# EAGLE design MPO21 (EAGLE 9.6.2)
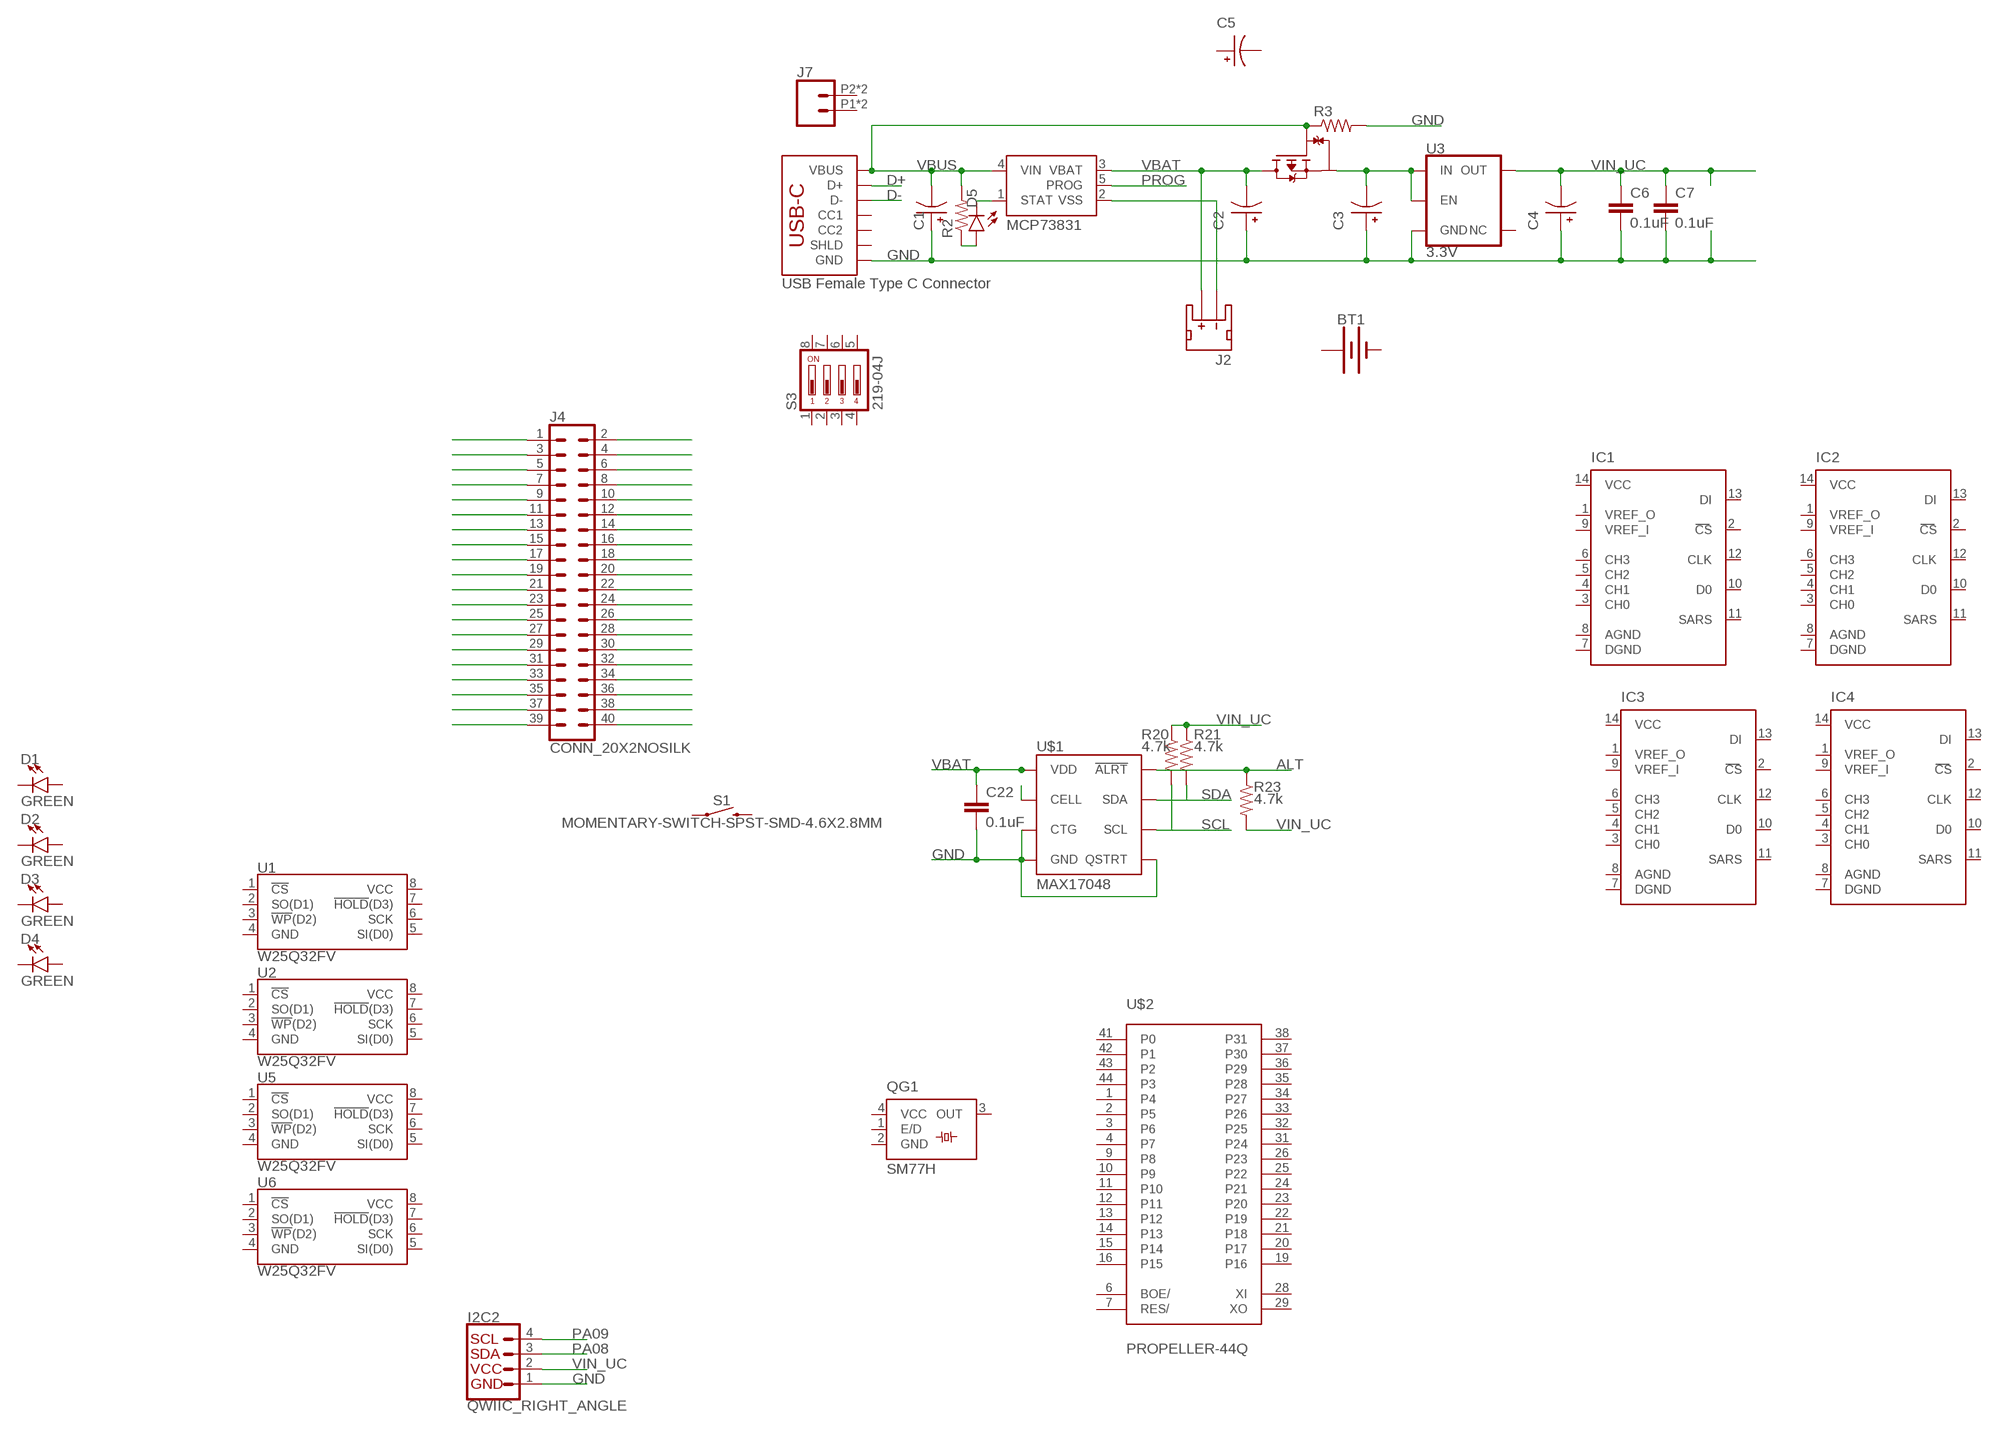
[diagram p0: schematic, sheet 1]

## Parts
BT1  BATTERY-20MM_SMD_4LEGS_OVERPASTE_INNER  [BATTCON_20MM_4LEGS_OVERPASTE_INNER]
C1  EEEFC1H1R0R  [CAP_EEEFC1H1R0R]
C2  EEEFC1H1R0R  [CAP_EEEFC1H1R0R]
C3  EEEFC1H1R0R  [CAP_EEEFC1H1R0R]
C4  EEEFC1H1R0R  [CAP_EEEFC1H1R0R]
C5  EEEFC1H1R0R  [CAP_EEEFC1H1R0R]
C6  0.1uF  C-EUC0603  [C0603]
C7  0.1uF  C-EUC0603  [C0603]
C22  0.1uF  C-EUC0603  [C0603]
D1  GREEN  LED-GREEN1206  [LED-1206]
D2  GREEN  LED-GREEN1206  [LED-1206]
D3  GREEN  LED-GREEN1206  [LED-1206]
D4  GREEN  LED-GREEN1206  [LED-1206]
D5  GREEN  LED-GREEN1206  [LED-1206]
I2C2  QWIIC_RIGHT_ANGLE  QWIIC_CONNECTORJS-1MM  [JST04_1MM_RA]
IC1  ADC08034D  [SO14]
IC2  ADC08034D  [SO14]
IC3  ADC08034D  [SO14]
IC4  ADC08034D  [SO14]
J2  JST_2MM_MALE  [JST-2-SMD]
J4  CONN_20X2NOSILK  [2X20_NOSILK]
J7  CONN_02SMALL_POKEHOME  [1X02_POKEHOME]
J9  USB Female Type C Connector  USB_C_4-LAYER-ISOLATED  [USB-C-16P-4LAYER-ISOLATED]
Q1  DMP1045U  [SOT91P240X110-3N]
QG1  SM77H  [SM77H]
R2  R-US_R0603  [R0603]
R3  R-US_R0603  [R0603]
R20  4.7k  R-US_R0603  [R0603]
R21  4.7k  R-US_R0603  [R0603]
R23  4.7k  R-US_R0603  [R0603]
S1  MOMENTARY-SWITCH-SPST-SMD-4.6X2.8MM  [TACTILE_SWITCH_SMD_4.6X2.8MM]
S3  219-04J  [CTS-219-04J]
U1  W25Q32FV  W25Q32FVSS  [SOIC-8]
U2  W25Q32FV  W25Q32FVSS  [SOIC-8]
U3  3.3V  V_REG_AP2112K-3.3V  [SOT23-5]
U4  MCP73831  [SOT23-5]
U5  W25Q32FV  W25Q32FVSS  [SOIC-8]
U6  W25Q32FV  W25Q32FVSS  [SOIC-8]
U$1  MAX17048  MAX17048DFN8  [DFN-8]
U$2  PROPELLER-44Q  [Q44]

## Nets
ALT: R23.1 U$1.P$5(!ALRT)
D+: J9.A6(D+) J9.B6(D+)
D-: J9.A7(D-) J9.B7(D-)
GND: C1.1 C2.1 C3.1 C4.1 C6.2 C7.2 C22.2 I2C2.1 J9.GND J9.GND2(GND) R3.2 U3.2(GND) U$1.P$1(CTG) U$1.P$4(GND) U$1.P$6(QSTRT) U$1.P$9(GND)
N$10: C3.2 Q1.2(S) U3.1(IN) U3.3(EN)
N$11: D5.C U4.1(STAT)
N$12: J2.1(-) U4.2(VSS)
N$13: D5.A R2.1
N$43: U$1.P$2(CELL)
N$90: J4.2
N$91: J4.3
N$92: J4.4
N$93: J4.5
N$94: J4.6
N$95: J4.7
N$96: J4.8
N$97: J4.9
N$98: J4.10
N$99: J4.11
N$100: J4.12
N$101: J4.13
N$102: J4.14
N$103: J4.15
N$104: J4.16
N$105: J4.17
N$106: J4.18
N$107: J4.19
N$108: J4.20
N$109: J4.21
N$110: J4.22
N$111: J4.23
N$112: J4.24
N$113: J4.25
N$114: J4.26
N$115: J4.27
N$116: J4.28
N$117: J4.29
N$118: J4.30
N$119: J4.31
N$120: J4.32
N$121: J4.33
N$122: J4.34
N$123: J4.35
N$124: J4.36
N$125: J4.37
N$126: J4.38
N$127: J4.39
N$128: J4.40
PA01: J4.1
PA08: I2C2.3
PA09: I2C2.4
PROG: U4.5(PROG)
SCL: R20.2 U$1.P$7(SCL)
SDA: R21.2 U$1.P$8(SDA)
VBAT: C2.2 C22.1 J2.2(+) Q1.3(D) U4.3(VBAT) U$1.P$3(VDD)
VBUS: C1.2 J9.VBUS1(VBUS) J9.VBUS2(VBUS) Q1.1(G) R2.2 R3.1 U4.4(VIN)
VIN_UC: C4.2 C6.1 C7.1 I2C2.2 R20.1 R21.1 R23.2 U3.5(OUT)
Unconnected: C5.1 C5.2 D1.A D1.C D2.A D2.C D3.A D3.C D4.A D4.C IC1.1(VREF_O) IC1.2(CS) IC1.3(CH0) IC1.4(CH1) IC1.5(CH2) IC1.6(CH3) IC1.9(VREF_I) IC1.10(D0) IC1.11(SARS) IC1.12(CLK) IC1.13(DI) IC2.1(VREF_O) IC2.2(CS) IC2.3(CH0) IC2.4(CH1) IC2.5(CH2) IC2.6(CH3) IC2.9(VREF_I) IC2.10(D0) IC2.11(SARS) IC2.12(CLK) IC2.13(DI) IC3.1(VREF_O) IC3.2(CS) IC3.3(CH0) IC3.4(CH1) IC3.5(CH2) IC3.6(CH3) IC3.9(VREF_I) IC3.10(D0) IC3.11(SARS) IC3.12(CLK) IC3.13(DI) IC4.1(VREF_O) IC4.2(CS) IC4.3(CH0) IC4.4(CH1) IC4.5(CH2) IC4.6(CH3) IC4.9(VREF_I) IC4.10(D0) IC4.11(SARS) IC4.12(CLK) IC4.13(DI) J2.NC1(PAD1) J2.NC2(PAD2) J7.P1 J7.P2 J7.P3 J7.P4 J9.A5(CC1) J9.B5(CC2) J9.SHLD1(SHLD) J9.SHLD2(SHLD) J9.SHLD3(SHLD) J9.SHLD4(SHLD) J9.SHLD5(SHLD) J9.SHLD6(SHLD) J9.SHLD7(SHLD) J9.SHLD8(SHLD) QG1.1(E/D) QG1.3(OUT) S1.1 S1.2 S1.3 S1.4 S3.1 S3.2 S3.3 S3.4 S3.5 S3.6 S3.7 S3.8 U1.1(!CS!) U1.2(SO(D1)) U1.3(!WP!(D2)) U1.4(GND) U1.5(SI(D0)) U1.6(SCK) U1.7(!HOLD!(D3)) U1.8(VCC) U2.1(!CS!) U2.2(SO(D1)) U2.3(!WP!(D2)) U2.4(GND) U2.5(SI(D0)) U2.6(SCK) U2.7(!HOLD!(D3)) U2.8(VCC) U3.4(NC) U5.1(!CS!) U5.2(SO(D1)) U5.3(!WP!(D2)) U5.4(GND) U5.5(SI(D0)) U5.6(SCK) U5.7(!HOLD!(D3)) U5.8(VCC) U6.1(!CS!) U6.2(SO(D1)) U6.3(!WP!(D2)) U6.4(GND) U6.5(SI(D0)) U6.6(SCK) U6.7(!HOLD!(D3)) U6.8(VCC) U$2.1(P4) U$2.2(P5) U$2.3(P6) U$2.4(P7) U$2.6(BOE/) U$2.7(RES/) U$2.9(P8) U$2.10(P9) U$2.11(P10) U$2.12(P11) U$2.13(P12) U$2.14(P13) U$2.15(P14) U$2.16(P15) U$2.19(P16) U$2.20(P17) U$2.21(P18) U$2.22(P19) U$2.23(P20) U$2.24(P21) U$2.25(P22) U$2.26(P23) U$2.28(XI) U$2.29(XO) U$2.31(P24) U$2.32(P25) U$2.33(P26) U$2.34(P27) U$2.35(P28) U$2.36(P29) U$2.37(P30) U$2.38(P31) U$2.41(P0) U$2.42(P1) U$2.43(P2) U$2.44(P3)

## Notes on the sheet
- R20 | R21
- R23

## Power pins joined to a net without a drawn wire
+: BT1.1(+)
-: BT1.2(-)
AGND: IC1.8(AGND) IC2.8(AGND) IC3.8(AGND) IC4.8(AGND)
DGND: IC1.7(DGND) IC2.7(DGND) IC3.7(DGND) IC4.7(DGND)
GND: QG1.2(GND)
VCC: IC1.14(VCC) IC2.14(VCC) IC3.14(VCC) IC4.14(VCC) QG1.4(VCC)
VDD: U$2.8(VDD) U$2.18(VDD) U$2.30(VDD) U$2.40(VDD)
VSS: U$2.5(VSS) U$2.17(VSS) U$2.27(VSS) U$2.39(VSS)

## Library data of the parts
BT1 = SparkFun-Batteries:BATTERY: Battery - Single Cell A variety of battery chemistries, sizes, and footprints. Device List: 20MM_PTH - Coin Cell Battery Holder - 20mm (PTH) <https://www.sparkfun.com/products/783> 20MM_PTH_KIT- Coin Cell battery Holder - 20 mm (PTH) <http://www.sparkfun.com/products/783>kit version with special mask 6.8MM_PTH - Coin Cell Battery Holder - 6.8MM(SMD) <https://www.digikey.com/product-detail/en/seiko-instruments/MS621FE-FL11E/728-1057-ND/1889208?WT.srch=1&gclid=CNOQ5a6LzdQCFZS2wAodXCkE0g> 12MM_SMD - Coin Cell Battery Holder - 12mm (SMD) <https://www.sparkfun.com/products/10592> 12MM_PTH - Coin Cell Battery Holder - 12mm (PTH) <https://www.sparkfun.com/products/7948> 20MM_SMD - 20mm Coin Cell Battery Holder (SMD) (2 legs) Used on the Big Time Watch Kit <https://www.sparkfun.com/products/11734> 20MM_SMD_4LEGS - Coin Cell Battery Holder - 20mm (SMD) <https://www.sparkfun.com/products/11892> 20MM_SMD_4LEGS_OVERPASTE - Coin Cell Battery Holder - 20mm (SMD) <https://www.sparkfun.com/products/11892> (Over-paste on the legs) 24.5MM_PTH - Coin Cell Battery Holder - 24.5mm (PTH) <https://www.sparkfun.com/products/8863> 9V - 9V Battery Holder - PC Mount Used on the SparkFun SparkPunk Sound Kit <https://www.sparkfun.com/products/11177> and SparkFun SparkPunk Sequencer Kit <https://www.sparkfun.com/products/12707> 18650 - Battery Holder - 18650 (PTH) <https://www.sparkfun.com/products/13113> AA - Battery Holder - 1xAA (PTH) <https://www.sparkfun.com/products/7949> AAA - Battery Holder - 1xAAA (PTH) <https://www.sparkfun.com/products/12718> AA_KIT - Battery Holder - 1xAA (PTH) <https://www.sparkfun.com/products/7949> Special kit package - pads only have exposed copper on one side of the board. AAA_KIT - Battery Holder - 1xAAA (PTH) <https://www.sparkfun.com/products/12718> Special kit package - pads only have exposed copper on one side of the board.
C1-C5 = EEEFC1H1R0R:EEEFC1H1R0R; MANUFACTURER: Panasonic; MAXIMUM_PACKAGE_HEIGHT: 5.4mm; PARTREV: 10-Oct-19; STANDARD: Manufacturer Recommendations
C6 C7 C22 = rcl:C-EU: CAPACITOR, European symbol; SPICEPREFIX: C
D1-D5 = SparkFun-LED:LED-GREEN: Green SMD LED Used in manufacturing of various products at SparkFun Packages: 0603 - SMD 0603 package [Product Link] <http://www.futureelectronics.com/en/technologies/semiconductors/optoelectronics/leds/Pages/9894312-LTST-C190GKT.aspx?CrossPart=HSMG-C190&IM=0> LilyPad 1206 - SMD1206 LilyPad package [Product Link] <http://www.futureelectronics.com/en/Technologies/Product.aspx?ProductID=IN150NGHARVATEKCORPORATION2049943&IM=0> 1206 - SMD1206 package [Product Link] <http://www.futureelectronics.com/en/technologies/semiconductors/optoelectronics/leds/Pages/8315665-LTST-C150KGKT.aspx?IM=0> 1206 Bottom Mount -SMD 1206 Bottom Mount [Product Link] <http://www.digikey.com/product-detail/en/lite-on-inc/LTST-C230KGKT/160-1456-1-ND/386854> SparkFun Products: Pro Mini 328 -5V <https://www.sparkfun.com/products/821> RedBoard <https://www.sparkfun.com/products/12757> MP3 Trigger <https://www.sparkfun.com/products/13720> Makey Makey <https://www.sparkfun.com/products/11076>; PROD_ID: DIO-00862
I2C2 = SparkFun-Connectors:QWIIC_CONNECTOR: SparkFun I2C Standard Qwiic Connector An SMD 1mm pitch JST connector makes it easy and quick (get it? Qwiic?) to connect I2C devices to each other. The Qwiic system <http://www.sparkfun.com/qwiic> enables fast and solderless connection between popular platforms and various sensors and actuators. We carry 200mm <https://www.sparkfun.com/products/14204>, 100mm <https://www.sparkfun.com/products/14205>, 50mm <https://www.sparkfun.com/products/14206>, and breadboard friendly <https://www.sparkfun.com/products/14207> Qwiic cables. We also offer 10 pcs strips <https://www.sparkfun.com/products/14323> the SMD connectors.; PROD_ID: CONN-13694
IC1-IC4 = linear:ADC08034: A/D CONVERTER
J2 = SparkFun-Connectors:JST_2MM_MALE: JST 2MM MALE RA CONNECTOR Two pin, compact surface mount connector. Commonly used as a battery input connection point. We really like the solid locking feeling and high current rating on these small connectors. We use these all the time as battery connectors. Mates to single-cell LiPo batteries. Here is the connector we sell at SparkFun: JST Right Angle Connector - White <https://www.sparkfun.com/products/8612> (PRT-08612) Datasheet <http://www.sparkfun.com/datasheets/Prototyping/Connectors/JST-Horizontal.pdf> It was used on these SparkFun products: SparkFun MOSFET Power Controller <https://www.sparkfun.com/products/11214> (PRT-11214) SparkFun Battery Babysitter - LiPo Battery Manager <https://www.sparkfun.com/products/13777> (PRT-13777) And many, many others that required a lipo battery connection.; PROD_ID: CONN-11443; SF_ID: PRT-08612
J4 = SparkFun-Connectors:CONN_20X2: Multi connection point. Often used as Generic Header-pin footprint for 0.1 inch spaced/style header connections On any of the 0.1 inch spaced packages, you can populate with these: Break Away Headers - Straight <https://www.sparkfun.com/products/116> (PRT-00116) Break Away Male Headers - Right Angle <https://www.sparkfun.com/products/553> (PRT-00553) Female Headers <https://www.sparkfun.com/products/115> (PRT-00115) Break Away Headers - Machine Pin <https://www.sparkfun.com/products/117> (PRT-00117) Break Away Female Headers - Swiss Machine Pin <https://www.sparkfun.com/products/743> (PRT-00743)
J7 = SparkFun-Connectors:CONN_02: Multi connection point. Often used as Generic Header-pin footprint for 0.1 inch spaced/style header connections On any of the 0.1 inch spaced packages, you can populate with these: Break Away Headers - Straight <https://www.sparkfun.com/products/116> (PRT-00116) Break Away Male Headers - Right Angle <https://www.sparkfun.com/products/553> (PRT-00553) Female Headers <https://www.sparkfun.com/products/115> (PRT-00115) Break Away Headers - Machine Pin <https://www.sparkfun.com/products/117> (PRT-00117) Break Away Female Headers - Swiss Machine Pin <https://www.sparkfun.com/products/743> (PRT-00743) For SCREWTERMINALS and SPRING TERMINALS visit here: Screw Terimnals on SparkFun.com <https://www.sparkfun.com/search/results?term=Screw+Terminals> (5mm/3.5mm/2.54mm spacing) This device is also useful as a general connection point to wire up your design to another part of your project. Our various solder wires solder well into these plated through hole pads. Hook-Up Wire - Assortment (Stranded, 22 AWG) <https://www.sparkfun.com/products/11375> (PRT-11375) Hook-Up Wire - Assortment (Solid Core, 22 AWG) <https://www.sparkfun.com/products/11367> (PRT-11367) View the entire wire category on our website here <https://www.sparkfun.com/categories/141> Special notes: Molex polarized connector foot print use with: PRT-08233 with associated crimp pins and housings. 2.54_SCREWTERM for use with PRT-10571. 3.5mm Screw Terminal footprints for PRT-08084 5mm Screw Terminal footprints for use with PRT-08432; PROD_ID: CONN-13512
J9 = SparkFun-Connectors:USB_C: USB Type C 16Pin Connector Super Speed pins not available on the 16-pin purely SMD connector so this part is best for USB 2.0 implementations. D1 and D2 are tied together enabling D+/- no matter which way the cable is plugged into the connector. The two channel configuration pins (CC1/2) are exposed. These are normally connected to ground via 5.1k resistors but can be reconfigured for high current/high power applications.; PROD_ID: CONN-14122
Q1 = DMP1045U:DMP1045U: P-Channel 12V 4A (Ta) 800mW (Ta) Surface Mount SOT-23 Check availability <https://pricing.snapeda.com/parts/DMP1045U/Diodes%20Inc./view-part?ref=eda>; AVAILABILITY: In Stock; DESCRIPTION: P-Channel 12 V 2.6A (Ta) 530mW Surface Mount X2-WLB0808-4 (Type C); MF: Diodes Inc.; MP: DMP1045U; PACKAGE: SOT-23 Diodes Inc.; PRICE: None; PURCHASE-URL: https://pricing.snapeda.com/search/part/DMP1045U/?ref=eda
QG1 = crystal:SM77H: 3.3V CMOS Clock Oscillator Source: www.pletronics.com .. sm77h%203.3v.pdf; OC_FARNELL: unknown; OC_NEWARK: unknown
R2 R3 R20 R21 R23 = rcl:R-US_: RESISTOR, American symbol; SPICEPREFIX: R
S1 = SparkFun-Switches:MOMENTARY-SWITCH-SPST: Momentary Switch (Pushbutton) - SPST Normally-open (NO) SPST momentary switches (buttons, pushbuttons). Variants PTH-12MM - 12mm square, through-hole Momentary Pushbutton Switch - 12mm Square <https://www.sparkfun.com/products/9190> (COM-09190) PTH-6.0MM, PTH-6.0MM-KIT - 6.0mm square, through-hole Mini Pushbutton Switch <https://www.sparkfun.com/products/97> (COM-00097) KIT package intended for soldering kit's - only one side of pads' copper is exposed. PTH-RIGHT-ANGLE-KIT - Right-angle, through-hole Right Angle Tactile Button <https://www.sparkfun.com/products/10791> - Used on SparkFun BigTime Watch Kit <https://www.sparkfun.com/products/11734> SMD-12MM - 12mm square, surface-mount Tactile Button - SMD (12mm) <https://www.sparkfun.com/products/12993> (COM-12993) Used on SparkFun PicoBoard <https://www.sparkfun.com/products/11888> SMD-4.5MM - 4.5mm Square Trackball Switch Used on SparkFun Blackberry Trackballer Breakout <https://www.sparkfun.com/products/13169> SMD-4.6MMX2.8MM - 4.60mm x 2.80mm, surface mount Used on SparkFun SAMD21 Mini Breakout <https://www.sparkfun.com/products/13664> SMD-5.2MM, SMD-5.2-REDUNDANT - 5.2mm square, surface-mount Mini Pushbutton Switch - SMD <https://www.sparkfun.com/products/8720> (COM-08720) Used on Arduino Pro Mini <https://www.sparkfun.com/products/11114> REDUNDANT package connects both switch circuits together SMD-6.0X3.5MM - 6.0 x 3.5mm, surface mount Momentary Reset Switch SMD <https://www.sparkfun.com/products/8229> (COM-08229) SMD-6.2MM-TALL - 6.2mm square, surface mount Tactile Button - SMD (6mm) <https://www.sparkfun.com/products/12992> Used on SparkFun Digital Sandbox <https://www.sparkfun.com/products/12651> SMD-RIGHT-ANGLE - Right-angle, surface mount Used on SparkFun Block for Intel® Edison - Arduino <https://www.sparkfun.com/products/13036>; PROD_ID: SWCH-13065
S3 = switch-dil:219-04*: Surface Mount DIP Switch Series 219 SMT CTS Electronic Components Sourc: www.ctscorp.com; OC_FARNELL: unknown; OC_NEWARK: unknown
U1 U2 U5 U6 = SparkFun-IC-Memory:W25Q32FV: W25Q32FV 32Mb (4MB) Serial Flash Memory The W25Q32FV support the standard Serial Peripheral Interface (SPI), Dual/Quad I/O SPI as well as 2-clocks instruction cycle Quad Peripheral Interface (QPI). 104MHz, SPI, 8-SOIC-EIAJ Datasheet <http://www.winbond.com/resource-files/w25q32fv%20revh%20091613.pdf> SparkFun Products SparkFun Blynk Board - ESP8266 <https://www.sparkfun.com/products/13794> (WRL-13794); PROD_ID: IC-13229
U3 = SparkFun-IC-Power:V_REG_AP2112: AP2112 - 600mA CMOS LDO Regulator w/ Enable The AP2112 is CMOS process low dropout linear regulator with enable function, the regulator delivers a guaranteed 600mA (min.) continuous load current. Features Output Voltage Accuracy: ±1.5% Output Current: 600mA (Min.) Foldback Short Current Protection: 50mA Enable Function to Turn ON/OFF VOUT Low Dropout Voltage (3.3V): 250mV (Typ.) @IOUT=600mA Excellent Load Regulation: 0.2%/A (Typ.) Excellent Line Regulation: 0.02%/V (Typ.) Low Quiescent Current: 55μA (Typ.) Low Standby Current: 0.01μA (Typ.) Low Output Noise: 50μVRMS PSRR: 100Hz -65dB, 1kHz -65dB OTSD Protection Stable with 1.0μF Flexible Cap: Ceramic, Tantalum and Aluminum Electrolytic Operation Temperature Range: -40°C to 85°C ESD: MM 400V, HBM 4000V; PROD_ID: VREG-12457
U4 = SparkFun-IC-Power:MCP73831: MCP73831T Li-Ion, Li-Pol Controller Miniature single cell, fully integrated Li-Ion, Li-polymer charge management controller Datasheet <http://ww1.microchip.com/downloads/en/DeviceDoc/20001984g.pdf> SparkFun Products: SparkFun ESP32 Thing <https://www.sparkfun.com/products/13907> SparkFun 9DoF Razor IMU M0 <https://www.sparkfun.com/products/14001>; PROD_ID: IC-09995
U$1 = SparkFun-IC-Power:MAX17048: Micropower 1-Cell Li+ ModelGauge SparkFun Products Qduino Mini <https://www.sparkfun.com/products/13614> (DEV-13614); PROD_ID: IC-12551
U$2 = Parallax:PROPELLER-44

## Board
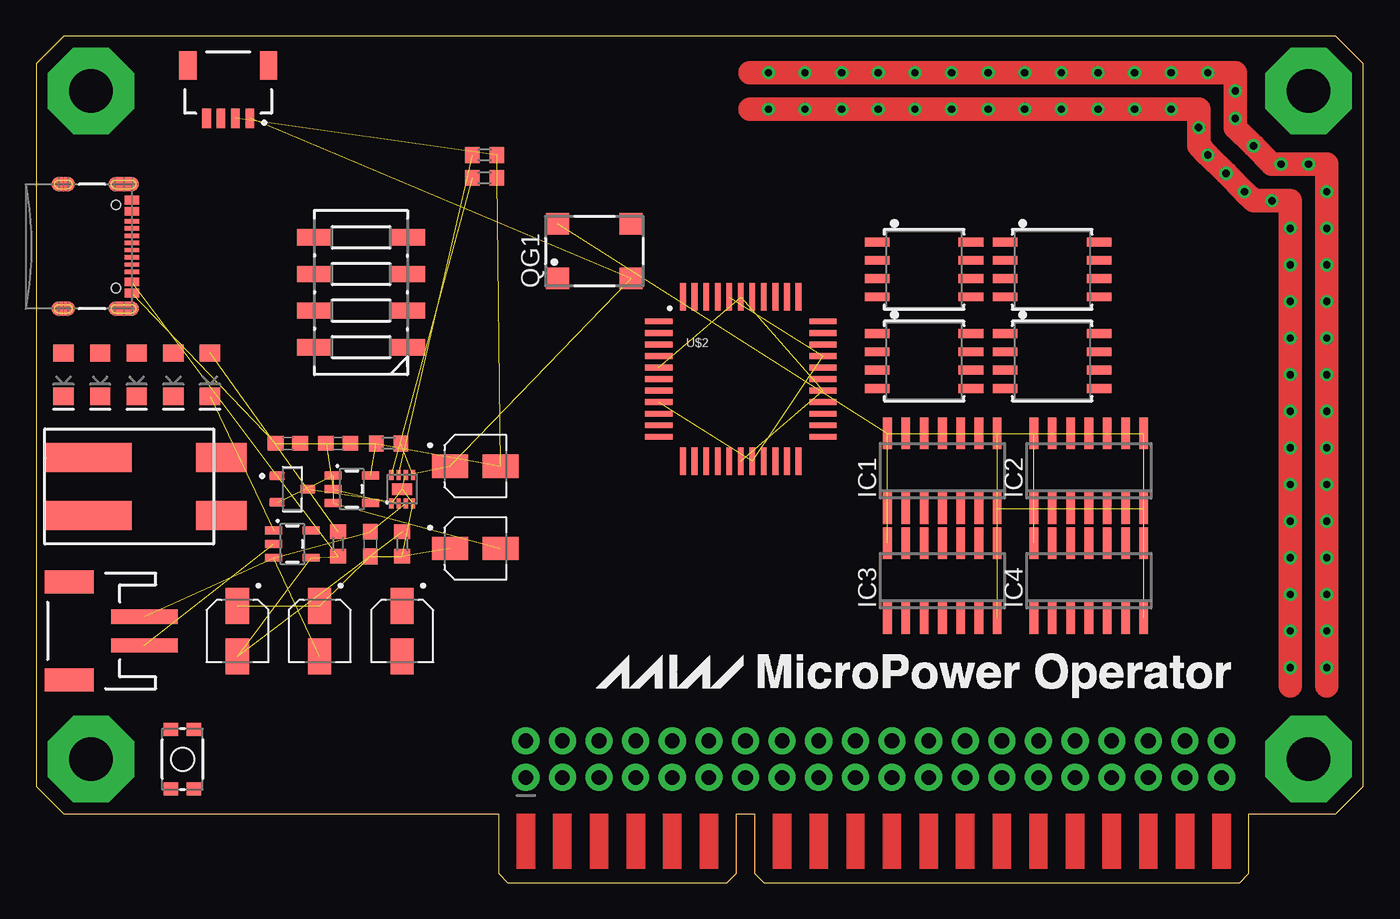
[diagram p1: board, top side]
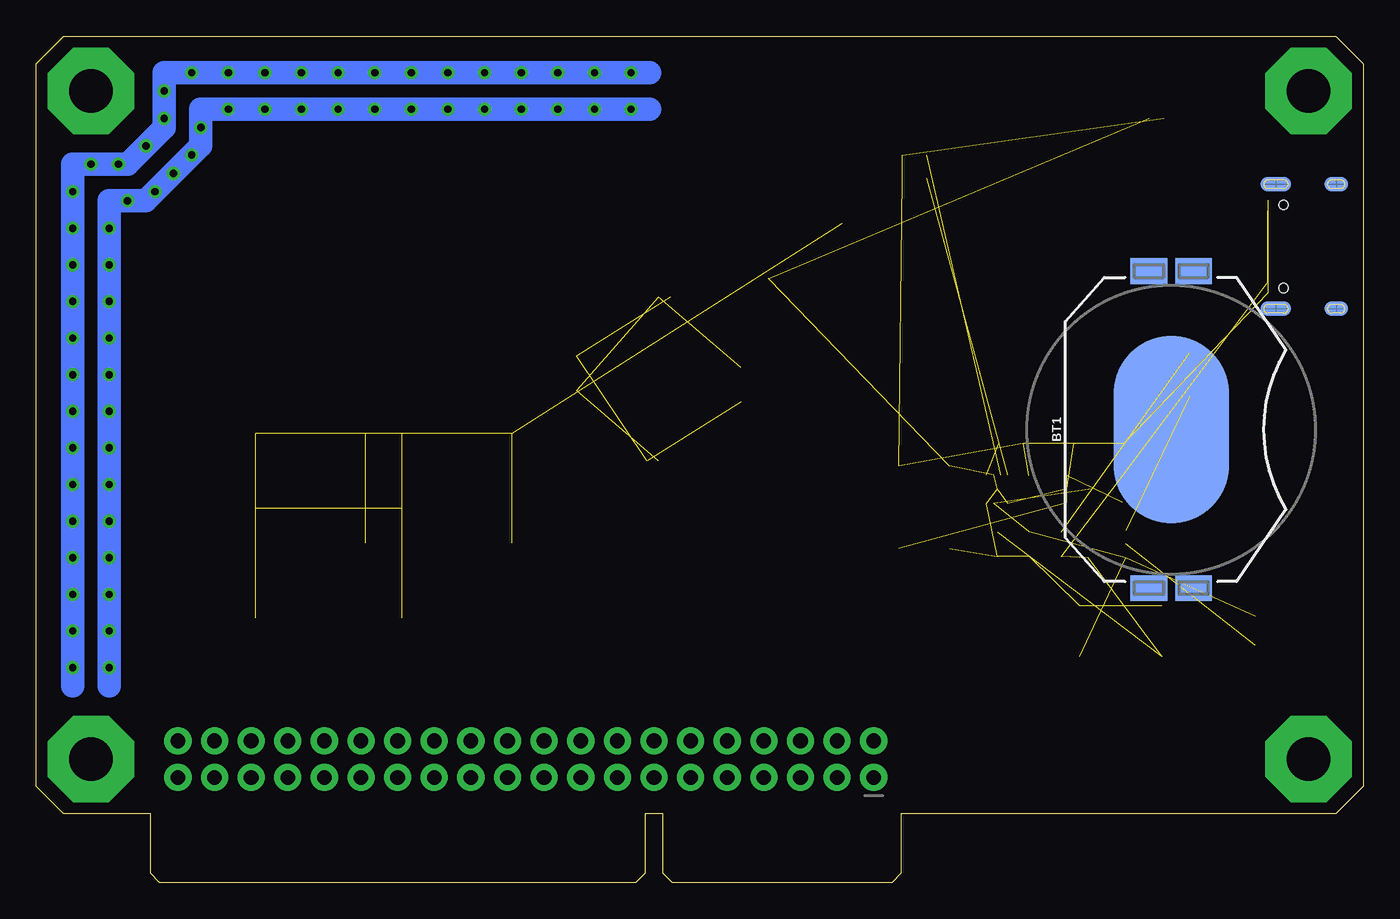
[diagram p2: board, bottom side, seen from below]

Size 92.07 x 58.74 mm. Coordinates in mm from the lower left corner, seen from the top.
Outline: 92.07,6.67 92.07,56.83 90.17,58.74 1.91,58.74 0,56.83 0,6.67 1.91,4.76 32.07,4.76 32.07,0.64 32.7,0 47.94,0 48.58,0.64 48.58,4.76 49.85,4.76 49.85,0.64 50.48,0 83.5,0 84.14,0.64 84.14,4.76 90.17,4.76 92.07,6.67
Copper layers (1*16): Top 0.035mm / dielectric 1.5mm / Bottom 0.035mm
Design rules "default": minimum track width 6mil, minimum drill 0.35mm, track to track 6mil, track to pad 6mil, pad to pad 6mil, via to via 6mil, smd to smd 6mil, copper to edge 40mil, drill to drill 6mil, minimum pad ring 10mil, minimum via ring 8mil, stop-mask expansion 4mil, vias tented up to drill 0mil, thermal gap 10mil

### Footprints (pad centres in the part's own frame; a part is rotated, then mirrored left to right if it is on the bottom)
BATTCON_20MM_4LEGS_OVERPASTE_INNER = smd 1.778 x 2.54: 1 -11,1.55; 3 11,1.55; P$1 -11,-1.55; P$2 11,-1.55 | smd 13 x 8: 2 0,0
CAP_EEEFC1H1R0R = smd 2.5 x 1.6: 1 -1.75,0; 2 1.75,0
C0603 = smd 1.1 x 1: 1 -0.85,0; 2 0.85,0
LED-1206 = smd 1.2 x 1.4: A -1.5,0; C 1.5,0
JST04_1MM_RA = smd 0.6 x 1.35: 1 -1.5,0; 2 -0.5,0; 3 0.5,0; 4 1.5,0 | smd 1.2 x 2: NC1 2.8,-3.675; NC2 -2.8,-3.675
SO14 = smd 0.6 x 2.2: 1 -3.81,-2.6; 2 -2.54,-2.6; 3 -1.27,-2.6; 4 0,-2.6; 5 1.27,-2.6; 6 2.54,-2.6; 7 3.81,-2.6; 8 3.81,2.6; 9 2.54,2.6; 10 1.27,2.6; 11 0,2.6; 12 -1.27,2.6; 13 -2.54,2.6; 14 -3.81,2.6
JST-2-SMD = smd 1 x 4.6: 1 -1,-3.7; 2 1,-3.7 | smd 1.6 x 3.4: NC1 -3.4,1.5; NC2 3.4,1.5
2X20_NOSILK = drill 1.016 pad 1.88: 1 0,0; 2 0,2.54; 3 2.54,0; 4 2.54,2.54; 5 5.08,0; 6 5.08,2.54; 7 7.62,0; 8 7.62,2.54; 9 10.16,0; 10 10.16,2.54; 11 12.7,0; 12 12.7,2.54; 13 15.24,0; 14 15.24,2.54; 15 17.78,0; 16 17.78,2.54; 17 20.32,0; 18 20.32,2.54; 19 22.86,0; 20 22.86,2.54; 21 25.4,0; 22 25.4,2.54; 23 27.94,0; 24 27.94,2.54; 25 30.48,0; 26 30.48,2.54; 27 33.02,0; 28 33.02,2.54; 29 35.56,0; 30 35.56,2.54; 31 38.1,0; 32 38.1,2.54; 33 40.64,0; 34 40.64,2.54; 35 43.18,0; 36 43.18,2.54; 37 45.72,0; 38 45.72,2.54; 39 48.26,0; 40 48.26,2.54
1X02_POKEHOME = smd 3.5 x 2: P1 5.25,2; P2 5.25,-2 | smd 6 x 2: P3 -4,2; P4 -4,-2
USB-C-16P-4LAYER-ISOLATED = smd 0.3 x 1: A5 -1.25,-0.34; A6 -0.25,-0.34; A7 0.25,-0.34; A8 1.25,-0.34; B5 1.75,-0.34; B6 0.75,-0.34; B7 -0.75,-0.34; B8 -1.75,-0.34 | smd 0.6 x 1: GND -3.225,-0.34; GND2 3.225,-0.34; VBUS1 -2.45,-0.34; VBUS2 2.45,-0.34 | smd 1 x 2.1: SHLD1 -4.32,-0.915; SHLD2 4.32,-0.915 | smd 1 x 2.1 bottom: SHLD3 -4.32,-0.915; SHLD4 4.32,-0.915 | smd 1 x 1.6: SHLD5 -4.32,-5.095; SHLD8 4.32,-5.095 | smd 1 x 1.6 bottom: SHLD6 -4.32,-5.095; SHLD7 4.32,-5.095 | hole 0.65: -2.89,-1.445; 2.89,-1.445
SOT91P240X110-3N = smd 1.09 x 0.61: 1 -1.07,0.915; 2 -1.07,-0.915; 3 1.07,0
SM77H = smd 1.6 x 1.5: 1 -2.55,-1.9; 2 2.55,-1.9; 3 2.55,1.9; 4 -2.55,1.9
R0603 = smd 1 x 1.1: 1 -0.85,0; 2 0.85,0
TACTILE_SWITCH_SMD_4.6X2.8MM = smd 0.9 x 1: 1 -2.05,-0.8; 2 2.05,-0.8; 3 2.05,0.8; 4 -2.05,0.8
CTS-219-04J = smd 1.13 x 2.44: 1 -3.81,-3.215; 2 -1.27,-3.215; 3 1.27,-3.215; 4 3.81,-3.215; 5 3.81,3.215; 6 1.27,3.215; 7 -1.27,3.215; 8 -3.81,3.215
SOIC-8 = smd 0.61 x 1.702: 1 -1.905,-3.251; 2 -0.635,-3.251; 3 0.635,-3.251; 4 1.905,-3.251; 5 1.905,3.251; 6 0.635,3.251; 7 -0.635,3.251; 8 -1.905,3.251
SOT23-5 = smd 0.55 x 1.2: 1 -0.95,-1.3; 2 0,-1.3; 3 0.95,-1.3; 4 0.95,1.3; 5 -0.95,1.3
DFN-8 = smd 0.3 x 0.7: P$1 -0.75,-0.99; P$2 -0.25,-0.99; P$3 0.25,-0.99; P$4 0.75,-0.99; P$5 0.75,0.99; P$6 0.25,0.99; P$7 -0.25,0.99; P$8 -0.75,0.99 | smd 1.38 x 0.8: P$9 0,0
Q44 = smd 1.9 x 0.4: 1 -5.713,4.013; 2 -5.713,3.212; 3 -5.713,2.413; 4 -5.713,1.613; 5 -5.713,0.812; 6 -5.713,0.013; 7 -5.713,-0.787; 8 -5.713,-1.587; 9 -5.713,-2.388; 10 -5.713,-3.188; 11 -5.713,-3.987; 23 5.688,-3.987; 24 5.688,-3.188; 25 5.688,-2.388; 26 5.688,-1.587; 27 5.688,-0.787; 28 5.688,0.013; 29 5.688,0.812; 30 5.688,1.613; 31 5.688,2.413; 32 5.688,3.212; 33 5.688,4.013 | smd 0.4 x 1.9: 12 -4.013,-5.688; 13 -3.212,-5.688; 14 -2.413,-5.688; 15 -1.613,-5.688; 16 -0.812,-5.688; 17 -0.013,-5.688; 18 0.787,-5.688; 19 1.587,-5.688; 20 2.388,-5.688; 21 3.188,-5.688; 22 3.987,-5.688; 34 3.987,5.713; 35 3.188,5.713; 36 2.388,5.713; 37 1.587,5.713; 38 0.787,5.713; 39 -0.013,5.713; 40 -0.812,5.713; 41 -1.613,5.713; 42 -2.413,5.713; 43 -3.212,5.713; 44 -4.013,5.713

### Placement (x,y rotation side)
BT1  13.34,31.43 90 bottom
C1  13.97,17.46 270 top
C2  19.68,17.46 270 top
C3  30.48,23.18 0 top
C4  30.48,28.89 0 top
C5  25.4,17.46 270 top
C6  17.46,30.48 180 top
C7  20.95,30.48 180 top
C22  23.18,23.5 270 top
D1  9.53,35.24 270 top
D2  6.99,35.24 270 top
D3  4.45,35.24 270 top
D4  1.91,35.24 270 top
D5  12.06,35.24 270 top
I2C2  13.34,53.02 180 top
IC1  62.87,28.57 0 top
IC2  73.02,28.57 0 top
IC3  62.87,20.96 0 top
IC4  73.02,20.96 0 top
J2  3.81,17.46 90 top
J4  33.97,7.3 0 top
J7  7.62,27.49 0 top
J9  6.99,44.13 270 top
Q1  17.78,27.31 0 top
QG1  38.73,43.81 0 top
R2  20.95,23.5 270 top
R3  25.4,23.5 270 top
R20  31.11,50.48 180 top
R21  31.11,48.89 180 top
R23  24.45,30.48 180 top
S1  10.16,8.57 90 top
S3  22.54,40.96 90 top
U1  61.59,42.55 270 top
U2  70.48,42.55 270 top
U3  21.91,27.31 270 top
U4  17.78,23.5 270 top
U5  61.59,36.2 270 top
U6  70.48,36.2 270 top
U$1  25.4,27.31 0 top
U$2  48.9,34.92 0 top

### Tracks (layer width: path | path; a pad name or v marks a point on that pad's centre or on a via)
AGND  (3 unrouted)
ALT  (1 unrouted)
D+  (1 unrouted)
D-  (1 unrouted)
DGND  (3 unrouted)
GND  (16 unrouted)
N$3  (via drill 3 pad 6)
  other vias: 3.81,54.93
N$4  (via drill 3 pad 6)
  other vias: 3.81,8.57
N$5  (via drill 3 pad 6)
  other vias: 88.27,8.57
N$6  (via drill 3 pad 6)
  other vias: 88.27,54.93
N$10  (3 unrouted)
N$11  (1 unrouted)
N$12  (1 unrouted)
N$13  (1 unrouted)
N$16  (via drill 0.51)
  other vias: 60.96,56.2
N$17  (via drill 0.51)
  other vias: 63.5,56.2
N$18  (via drill 0.51)
  other vias: 66.04,56.2
N$19  (via drill 0.51)
  other vias: 60.96,53.66
N$20  (via drill 0.51)
  other vias: 63.5,53.66
N$21  (via drill 0.51)
  other vias: 66.04,53.66
N$22  (via drill 0.51)
  other vias: 68.58,56.2
N$23  (via drill 0.51)
  other vias: 71.12,56.2
N$24  (via drill 0.51)
  other vias: 73.66,56.2
N$25  (via drill 0.51)
  other vias: 68.58,53.66
N$26  (via drill 0.51)
  other vias: 71.12,53.66
N$27  (via drill 0.51)
  other vias: 73.66,53.66
N$28  (via drill 0.51)
  other vias: 76.2,56.2
N$29  (via drill 0.51)
  other vias: 78.74,56.2
N$30  (via drill 0.51)
  other vias: 81.28,56.2
N$31  (via drill 0.51)
  other vias: 89.53,42.86
N$32  (via drill 0.51)
  other vias: 89.53,45.4
N$33  (via drill 0.51)
  other vias: 89.53,47.94
N$34  (via drill 0.51)
  other vias: 89.53,35.24
N$35  (via drill 0.51)
  other vias: 89.53,37.78
N$36  (via drill 0.51)
  Top 1.626: 89.53,13.65 89.53,49.85 v88.27,49.85 v86.36,49.85 85.72,49.85 v84.45,51.12 83.18,52.39 v83.18,53.02 v83.18,54.93 83.18,56.2 v58.42,56.2 v55.88,56.2 v53.34,56.2 v50.8,56.2 49.53,56.2
N$37  (via drill 0.51)
  Top 1.626: 86.99,13.65 86.99,47.31 v85.72,47.31 84.45,47.31 v83.82,47.94 v82.55,49.21 v81.28,50.48 80.64,51.12 v80.64,52.39 80.64,53.66 v78.74,53.66 v76.2,53.66 v58.42,53.66 v55.88,53.66 v53.34,53.66 v50.8,53.66 49.53,53.66
N$38  (via drill 0.51)
  other vias: 89.53,40.32
N$39  (via drill 0.51)
  other vias: 86.99,40.32
N$40  (via drill 0.51)
  other vias: 86.99,42.86
N$41  (via drill 0.51)
  other vias: 86.99,45.4
N$44
  Bottom 1.626: 89.53,13.65 89.53,49.85 85.72,49.85 83.18,52.39 83.18,56.2 49.53,56.2
N$45  (via drill 0.51)
  other vias: 86.99,32.7
N$46  (via drill 0.51)
  other vias: 86.99,35.24
N$47  (via drill 0.51)
  other vias: 86.99,37.78
N$48  (via drill 0.51)
  other vias: 89.53,27.62
N$49  (via drill 0.51)
  other vias: 89.53,30.16
N$50  (via drill 0.51)
  other vias: 89.53,32.7
N$51  (via drill 0.51)
  other vias: 86.99,25.08
N$52  (via drill 0.51)
  other vias: 86.99,27.62
N$53  (via drill 0.51)
  other vias: 86.99,30.16
N$54  (via drill 0.51)
  other vias: 89.53,20
N$55  (via drill 0.51)
  other vias: 89.53,22.54
N$56  (via drill 0.51)
  other vias: 89.53,25.08
N$57  (via drill 0.51)
  other vias: 86.99,17.46
N$58  (via drill 0.51)
  other vias: 86.99,20
N$59  (via drill 0.51)
  other vias: 86.99,22.54
N$60
  Bottom 1.626: 86.99,13.65 86.99,47.31 84.45,47.31 80.64,51.12 80.64,53.66 49.53,53.66
N$61  (via drill 0.51)
  other vias: 89.53,14.92
N$62  (via drill 0.51)
  other vias: 86.99,14.92
N$65  (via drill 0.51)
  other vias: 89.53,17.46
SCL  (1 unrouted)
SDA  (1 unrouted)
VBAT  (5 unrouted)
VBUS  (6 unrouted)
VCC  (4 unrouted)
VDD  (3 unrouted)
VIN_UC  (7 unrouted)
VSS  (3 unrouted)
(copper drawn outside any net)
  shapes: Top area x19